# Altium schematic sheet microcontroller.SchDoc
size A4; SheetNumber: 1; SheetTotal: 6
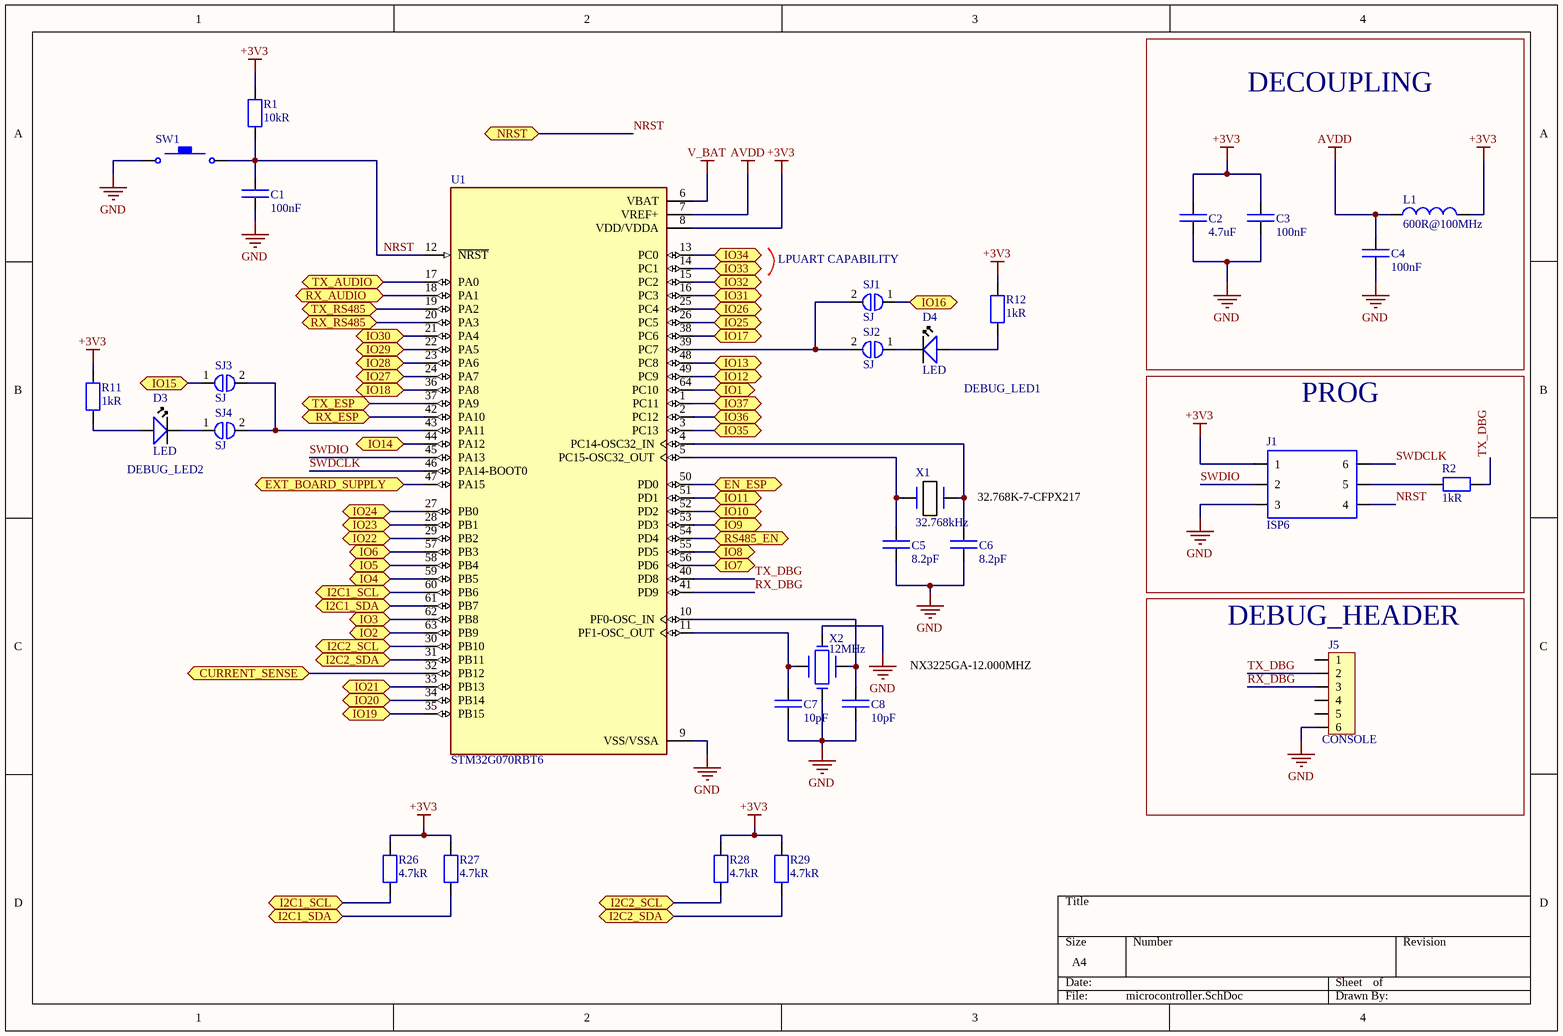
[diagram p0: microcontroller.SchDoc]

## Parts
C1  100nF  [C0603]
C2  4.7uF  [C0805]
C3  100nF  [C0603]
C4  100nF  [C0603]
C5  8.2pF  [C0603]
C6  8.2pF  [C0603]
C7  10pF  [C0603]
C8  10pF  [C0603]
D3  LED  [LED0805]
D4  LED  [LED0805]
J1  ISP6  [ISP-6]
J5  CONSOLE  [pin_header_6_male]
L1  600R@100MHz  [R0603]
R1  10kR  [R0603]
R2  1kR  [R0603]
R11  1kR  [R0603]
R12  1kR  [R0603]
R26  4.7kR  [R0805]
R27  4.7kR  [R0805]
R28  4.7kR  [R0805]
R29  4.7kR  [R0805]
SJ1  SJ  [SJ]
SJ2  SJ  [SJ]
SJ3  SJ  [SJ]
SJ4  SJ  [SJ]
SW1  tactile_switch  [tact_sw_3mmx4mm]  (value not drawn)
U1  STM32G070RBT6  [STM32]
X1  32.768kHz  [XTAL_2PIN_3.2X1.5mm]
X2  12MHz  [XTAL_4PIN_3.2x2.5mm]

## Blocks framed on the sheet
DECOUPLING: C2-C4 L1
PROG: J1 R2
DEBUG_HEADER: J5

## Ports
CURRENT_SENSE (bidir), EN_ESP (bidir), EXT_BOARD_SUPPLY (bidir), I2C1_SCL (bidir), I2C1_SDA (bidir), I2C2_SCL (bidir), I2C2_SDA (bidir), IO1 (bidir), IO2 (bidir), IO3 (bidir), IO4 (bidir), IO5 (bidir), IO6 (bidir), IO7 (bidir), IO8 (bidir), IO9 (bidir), IO10 (bidir), IO11 (bidir), IO12 (bidir), IO13 (bidir), IO14 (bidir), IO15 (bidir), IO16 (bidir), IO17 (bidir), IO18 (bidir), IO19 (bidir), IO20 (bidir), IO21 (bidir), IO22 (bidir), IO23 (bidir), IO24 (bidir), IO25 (bidir), IO26 (bidir), IO27 (bidir), IO28 (bidir), IO29 (bidir), IO30 (bidir), IO31 (bidir), IO32 (bidir), IO33 (bidir), IO34 (bidir), IO35 (bidir), IO36 (bidir), IO37 (bidir), NRST (bidir), RS485_EN (bidir), RX_AUDIO (bidir), RX_ESP (bidir), RX_RS485 (bidir), TX_AUDIO (bidir), TX_ESP (bidir), TX_RS485 (bidir)

## Nets
+3V3: C2.2 C3.2 J1.1 L1.2 R1.2 R11.2 R12.2 R26.2 R27.2 R28.2 R29.2 U1.8(VDD/VDDA)
AVDD: C4.2 L1.1 U1.7(VREF+)
GND: C1.1 C2.1 C3.1 C4.1 C5.1 C6.1 C7.1 C8.1 J1.3 J5.6 SW1.1 U1.9(VSS/VSSA) X2.2 X2.4
V_BAT: U1.6(VBAT)
CURRENT_SENSE: U1.32(PB12) ; port CURRENT_SENSE
EN_ESP: U1.50(PD0) ; port EN_ESP
EXT_BOARD_SUPPLY: U1.47(PA15) ; port EXT_BOARD_SUPPLY
I2C1_SCL: R26.1 U1.60(PB6) ; port I2C1_SCL
I2C1_SDA: R27.1 U1.61(PB7) ; port I2C1_SDA
I2C2_SCL: R28.1 U1.30(PB10) ; port I2C2_SCL
I2C2_SDA: R29.1 U1.31(PB11) ; port I2C2_SDA
IO1: U1.64(PC10) ; port IO1
IO2: U1.63(PB9) ; port IO2
IO3: U1.62(PB8) ; port IO3
IO4: U1.59(PB5) ; port IO4
IO5: U1.58(PB4) ; port IO5
IO6: U1.57(PB3) ; port IO6
IO7: U1.56(PD6) ; port IO7
IO8: U1.55(PD5) ; port IO8
IO9: U1.53(PD3) ; port IO9
IO10: U1.52(PD2) ; port IO10
IO11: U1.51(PD1) ; port IO11
IO12: U1.49(PC9) ; port IO12
IO13: U1.48(PC8) ; port IO13
IO14: U1.44(PA12) ; port IO14
IO15: SJ3.1 ; port IO15
IO16: SJ1.1 ; port IO16
IO17: U1.38(PC6) ; port IO17
IO18: U1.36(PA8) ; port IO18
IO19: U1.35(PB15) ; port IO19
IO20: U1.34(PB14) ; port IO20
IO21: U1.33(PB13) ; port IO21
IO22: U1.29(PB2) ; port IO22
IO23: U1.28(PB1) ; port IO23
IO24: U1.27(PB0) ; port IO24
IO25: U1.26(PC5) ; port IO25
IO26: U1.25(PC4) ; port IO26
IO27: U1.24(PA7) ; port IO27
IO28: U1.23(PA6) ; port IO28
IO29: U1.22(PA5) ; port IO29
IO30: U1.21(PA4) ; port IO30
IO31: U1.16(PC3) ; port IO31
IO32: U1.15(PC2) ; port IO32
IO33: U1.14(PC1) ; port IO33
IO34: U1.13(PC0) ; port IO34
IO35: U1.3(PC13) ; port IO35
IO36: U1.2(PC12) ; port IO36
IO37: U1.1(PC11) ; port IO37
NRST: C1.2 J1.4 R1.1 SW1.3 U1.12(~{NRST}) ; port NRST
RS485_EN: U1.54(PD4) ; port RS485_EN
RX_AUDIO: U1.18(PA1) ; port RX_AUDIO
RX_DBG: J5.3 U1.41(PD9)
RX_ESP: U1.42(PA10) ; port RX_ESP
RX_RS485: U1.20(PA3) ; port RX_RS485
SWDCLK: J1.6 U1.46(PA14-BOOT0)
SWDIO: J1.2 U1.45(PA13)
TX_AUDIO: U1.17(PA0) ; port TX_AUDIO
TX_DBG: J5.2 R2.2 U1.40(PD8)
TX_ESP: U1.37(PA9) ; port TX_ESP
TX_RS485: U1.19(PA2) ; port TX_RS485
NetC5_2: C5.2 U1.5(PC15-OSC32_OUT) X1.1
NetC6_2: C6.2 U1.4(PC14-OSC32_IN) X1.2
NetC7_2: C7.2 U1.11(PF1-OSC_OUT) X2.1
NetC8_2: C8.2 U1.10(PF0-OSC_IN) X2.3
NetD3_A: D3.A R11.1
NetD3_K: D3.K SJ4.1
NetD4_A: D4.A R12.1
NetD4_K: D4.K SJ2.1
NetJ1_5: J1.5 R2.1
NetSJ1_2: SJ1.2 SJ2.2 U1.39(PC7)
NetSJ3_2: SJ3.2 SJ4.2 U1.43(PA11)

Not connected (* = marked no-connect by the designer): J5 1 4 5

## Notes on the sheet
- (near SJ1) LPUART CAPABILITY
- DEBUG_LED1
- DEBUG_LED2
- 32.768K-7-CFPX217
- NX3225GA-12.000MHZ

## Library data of the parts
C1-C8 = Cap_SMD
J5 = GOLDPIN_6
L1 = Inductor
R1 R2 R11 R12 R26-R29 = Res
U1 = STM32G070RBT6: ARMÂ® CortexÂ®-M0+ STM32G0 Microcontroller IC 32-Bit 64MHz 128KB _128K x 8_ FLASH 64-LQFP _10x10_; MF: STMicroelectronics; Package: LQFP-64 STMicroelectronics; MP: STM32G070RBT6; Value: *; Availability: Unavailable; SnapEDA_Link: https://www.snapeda.com/parts/STM32G070RBT6/STMicroelectronics/view-part/3616430/?ref=snap; Price: None
X1 = XTAL_2PIN: 32.768K-7-CFPX217
X2 = XTAL_4PIN: NX3225GA-12.000MHZ